# Altium schematic sheet new.SchDoc
size A2
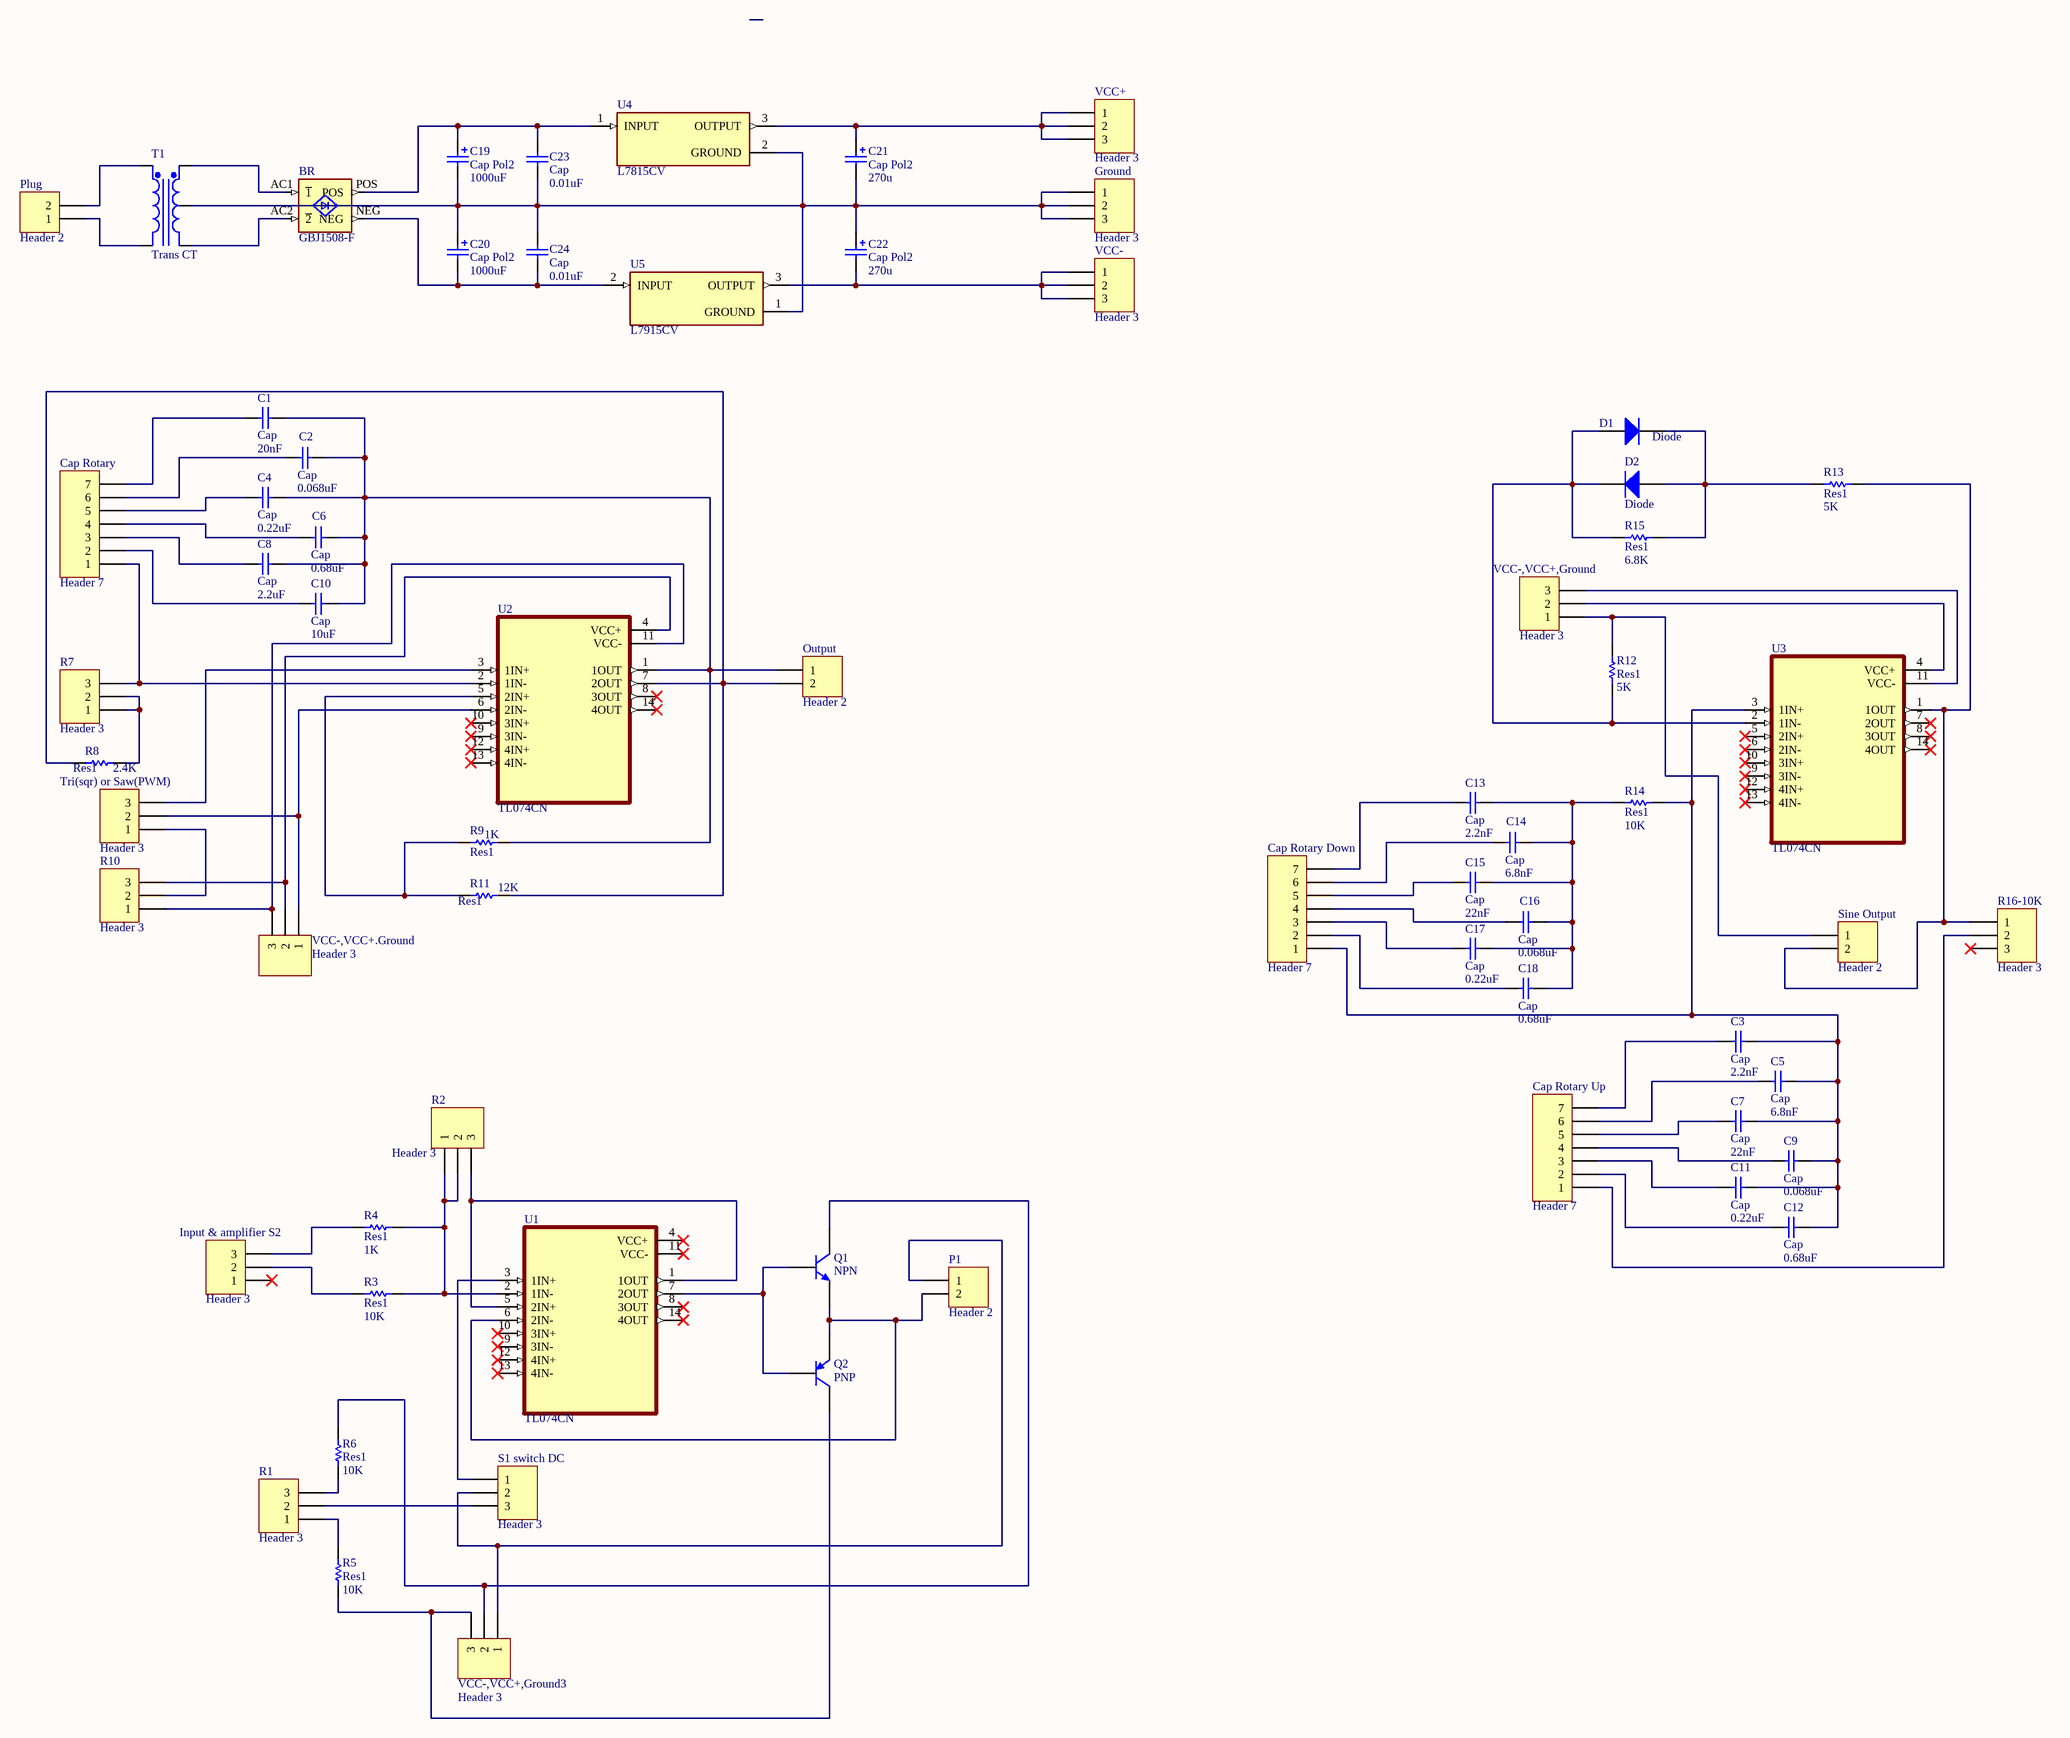
[diagram p0: new.SchDoc]

## Parts
BR  GBJ1508-F  [DIO_GBJ1508-F]
C1  Cap  value 20nF  [RAD-0.3]
C2  Cap  value 0.068uF  [RAD-0.3]
C3  Cap  value 2.2nF  [RAD-0.3]
C4  Cap  value 0.22uF  [RAD-0.3]
C5  Cap  value 6.8nF  [RAD-0.3]
C6  Cap  value 0.68uF  [RAD-0.3]
C7  Cap  value 22nF  [RAD-0.3]
C8  Cap  value 2.2uF  [RAD-0.3]
C9  Cap  value 0.068uF  [RAD-0.3]
C10  Cap  value 10uF  [RAD-0.3]
C11  Cap  value 0.22uF  [RAD-0.3]
C12  Cap  value 0.68uF  [RAD-0.3]
C13  Cap  value 2.2nF  [RAD-0.3]
C14  Cap  value 6.8nF  [RAD-0.3]
C15  Cap  value 22nF  [RAD-0.3]
C16  Cap  value 0.068uF  [RAD-0.3]
C17  Cap  value 0.22uF  [RAD-0.3]
C18  Cap  value 0.68uF  [RAD-0.3]
C19  Cap Pol2  value 1000uF  [POLAR0.8]
C20  Cap Pol2  value 1000uF  [POLAR0.8]
C21  Cap Pol2  value 270u  [POLAR0.8]
C22  Cap Pol2  value 270u  [POLAR0.8]
C23  Cap  value 0.01uF  [RAD-0.3]
C24  Cap  value 0.01uF  [RAD-0.3]
Cap_Rotary  Header 7  [HDR1X7]
Cap_Rotary_Down  Header 7  [HDR1X7]
Cap_Rotary_Up  Header 7  [HDR1X7]
D1  Diode  [SMC]
D2  Diode  [SMC]
Ground  Header 3  [HDR1X3]
Input_&_amplifier_S2  Header 3  [HDR1X3]
Output  Header 2  [HDR1X2]
P1  Header 2  [HDR1X2]
Plug  Header 2  [HDR1X2]
Q1  NPN  [TO-226-AA]
Q2  PNP  [SOT-23B_N]
R1  Header 3  [HDR1X3]
R2  Header 3  [HDR1X3]
R3  Res1  value 10K  [AXIAL-0.3]
R4  Res1  value 1K  [AXIAL-0.3]
R5  Res1  value 10K  [AXIAL-0.3]
R6  Res1  value 10K  [AXIAL-0.3]
R7  Header 3  [HDR1X3]
R8  Res1  value 2.4K  [AXIAL-0.3]
R9  Res1  value 1K  [AXIAL-0.3]
R10  Header 3  [HDR1X3]
R11  Res1  value 12K  [AXIAL-0.3]
R12  Res1  value 5K  [AXIAL-0.3]
R13  Res1  value 5K  [AXIAL-0.3]
R14  Res1  value 10K  [AXIAL-0.3]
R15  Res1  value 6.8K  [AXIAL-0.3]
R16-10K  Header 3  [HDR1X3]
S1_switch_DC  Header 3  [HDR1X3]
Sine_Output  Header 2  [HDR1X2]
T1  Trans CT  [TRF_5]
Tri(sqr)_or_Saw(PWM)  Header 3  [HDR1X3]
U1  TL074CN  [DIP794W45P254L1969H508Q14]
U2  TL074CN  [DIP794W45P254L1969H508Q14]
U3  TL074CN  [DIP794W45P254L1969H508Q14]
U4  L7815CV  [TO255P1040X460X1935-3]
U5  L7915CV  [TO255P1040X460X1935-3]
VCC+  Header 3  [HDR1X3]
VCC-  Header 3  [HDR1X3]
VCC-,VCC+,Ground  Header 3  [HDR1X3]
VCC-,VCC+,Ground3  Header 3  [HDR1X3]
VCC-,VCC+.Ground  Header 3  [HDR1X3]

## Nets
NetBR_AC1: BR.AC1(~{1}) T1.3(Sec+)
NetBR_AC2: BR.AC2(~{2}) T1.5(Sec-)
NetBR_NEG: BR.NEG C20.2 C24.1 U5.2(INPUT)
NetBR_POS: BR.POS C19.1 C23.2 U4.1(INPUT)
NetC1_1: C1.1 Cap_Rotary.7
NetC1_2: C1.2 C2.2 C4.2 C6.2 C8.2 C10.2 Output.1 R9.1 U2.1(1OUT)
NetC2_1: C2.1 Cap_Rotary.6
NetC3_1: C3.1 Cap_Rotary_Up.7
NetC3_2: C3.2 C5.2 C7.2 C9.2 C11.2 C12.2 Cap_Rotary_Down.1 R14.2 U3.3(1IN+)
NetC4_1: C4.1 Cap_Rotary.5
NetC5_1: C5.1 Cap_Rotary_Up.6
NetC6_1: C6.1 Cap_Rotary.4
NetC7_1: C7.1 Cap_Rotary_Up.5
NetC8_1: C8.1 Cap_Rotary.3
NetC9_1: C9.1 Cap_Rotary_Up.4
NetC10_1: C10.1 Cap_Rotary.2
NetC11_1: C11.1 Cap_Rotary_Up.3
NetC12_1: C12.1 Cap_Rotary_Up.2
NetC13_1: C13.1 Cap_Rotary_Down.7
NetC13_2: C13.2 C14.2 C15.2 C16.2 C17.2 C18.2 R14.1
NetC14_1: C14.1 Cap_Rotary_Down.6
NetC15_1: C15.1 Cap_Rotary_Down.5
NetC16_1: C16.1 Cap_Rotary_Down.4
NetC17_1: C17.1 Cap_Rotary_Down.3
NetC18_1: C18.1 Cap_Rotary_Down.2
NetC19_2: C19.2 C20.1 C21.2 C22.1 C23.1 C24.2 Ground.1 Ground.2 Ground.3 T1.4(SecCT) U4.2(GROUND) U5.1(GROUND)
NetC21_1: C21.1 U4.3(OUTPUT) VCC+.1 VCC+.2 VCC+.3
NetC22_2: C22.2 U5.3(OUTPUT) VCC-.1 VCC-.2 VCC-.3
NetCap_Rotary_1: Cap_Rotary.1 R7.3 U2.2(1IN-)
NetCap_Rotary_Up_1: Cap_Rotary_Up.1 R16-10K.2
NetD1_1: D1.1(A) D2.2(K) R12.1 R15.1 U3.2(1IN-)
NetD1_2: D1.2(K) D2.1(A) R13.1 R15.2
NetInput_&_amplifier_S2_2: Input_&_amplifier_S2.2 R3.1
NetInput_&_amplifier_S2_3: Input_&_amplifier_S2.3 R4.1
NetOutput_2: Output.2 R8.1 R11.2 U2.7(2OUT)
NetP1_1: P1.1 S1_switch_DC.2 VCC-,VCC+,Ground3.1
NetP1_2: P1.2 Q1.3(E) Q2.3(E) U1.6(2IN-)
NetPlug_1: Plug.1 T1.2(Pri-)
NetPlug_2: Plug.2 T1.1(Pri+)
NetQ1_1: Q1.1(C) R6.2 VCC-,VCC+,Ground3.2
NetQ1_2: Q1.2(B) Q2.2(B) U1.7(2OUT)
NetQ2_1: Q2.1(C) R5.1 VCC-,VCC+,Ground3.3
NetR1_1: R1.1 R5.2
NetR1_2: R1.2 S1_switch_DC.3
NetR1_3: R1.3 R6.1
NetR2_1: R2.1 R2.2 R3.2 R4.2 U1.2(1IN-)
NetR2_3: R2.3 U1.1(1OUT) U1.5(2IN+)
NetR7_1: R7.1 R7.2 R8.2
NetR9_2: R9.2 R11.1 U2.5(2IN+)
NetR10_1: R10.1 U2.11(VCC-) VCC-,VCC+.Ground.3
NetR10_2: R10.2 Tri(sqr)_or_Saw(PWM).1
NetR10_3: R10.3 U2.4(VCC+) VCC-,VCC+.Ground.2
NetR12_2: R12.2 Sine_Output.1 VCC-,VCC+,Ground.1
NetR13_2: R13.2 R16-10K.1 Sine_Output.2 U3.1(1OUT)
NetS1_switch_DC_1: S1_switch_DC.1 U1.3(1IN+)
NetTri(sqr)_or_Saw(PWM)_2: Tri(sqr)_or_Saw(PWM).2 U2.6(2IN-) VCC-,VCC+.Ground.1
NetTri(sqr)_or_Saw(PWM)_3: Tri(sqr)_or_Saw(PWM).3 U2.3(1IN+)
NetU3_4: U3.4(VCC+) VCC-,VCC+,Ground.2
NetU3_11: U3.11(VCC-) VCC-,VCC+,Ground.3

Not connected (* = marked no-connect by the designer): Input_&_amplifier_S2 1*; R16-10K 3*; U1 4(VCC+)* 8(3OUT)* 9(3IN-)* 10(3IN+)* 11(VCC-)* 12(4IN+)* 13(4IN-)* 14(4OUT)*; U2 8(3OUT)* 9(3IN-)* 10(3IN+)* 12(4IN+)* 13(4IN-)* 14(4OUT)*; U3 5(2IN+)* 6(2IN-)* 7(2OUT)* 8(3OUT)* 9(3IN-)* 10(3IN+)* 12(4IN+)* 13(4IN-)* 14(4OUT)*

## Library data of the parts
BR = GBJ1508-F: Bridge Rectifier Single Phase Standard 800V Through Hole GBJ; MF: Diodes Inc.; Value: *; SnapEDA_Link: https://www.snapeda.com/parts/GBJ1508-F/Diodes%20Inc./view-part/130069/?ref=snap; Mouser-Purchase-URL: https://snapeda.com/shop?store=Mouser&id=130069; Availability: Unavailable; Price: None; Package: SIP-4 Diodes Inc.; MP: GBJ1508-F
C1-C18 C23 C24 = Cap: Capacitor; Published: 8-Jun-2000; LatestRevisionDate: 17-Jul-2002; LatestRevisionNote: Re-released for DXP Platform.; PackageReference: RAD-0.3; Publisher: Altium Limited; PackageDescription: Radial Cap, Thru-Hole; 2 Leads; 0.3 in Pin Spacing
C19-C22 = Cap Pol2: Polarized Capacitor (Axial); Published: 8-Jun-2000; LatestRevisionDate: 17-Jul-2002; LatestRevisionNote: Re-released for DXP Platform.; PackageReference: POLAR0.8; Publisher: Altium Limited; PackageDescription: Polarized Capacitor; 2 Leads
Cap_Rotary Cap_Rotary_Down Cap_Rotary_Up = Header 7: Header, 7-Pin; LatestRevisionDate: 17-Jul-2002; LatestRevisionNote: Re-released for DXP Platform.; Publisher: Altium Limited
D1 D2 = Diode: Default Diode; Published: 8-Jun-2000; LatestRevisionDate: 17-Jul-2002; LatestRevisionNote: Re-released for DXP Platform.; PackageVersion: Sep-1996; PackageReference: SMC; Publisher: Altium Limited; PackageDescription: DO-214-AB/SMC; 2 C-Bend Leads; Body 7.9 x 5.9 mm, inc. leads (LxW); Code_JEDEC: DO-214-AB
Ground Input_&_amplifier_S2 R1 R2 R7 R10 R16-10K S1_switch_DC Tri(sqr)_or_Saw(PWM) VCC+ VCC- VCC-,VCC+,Ground VCC-,VCC+,Ground3 VCC-,VCC+.Ground = Header 3: Header, 3-Pin; LatestRevisionDate: 17-Jul-2002; LatestRevisionNote: Re-released for DXP Platform.; Publisher: Altium Limited
Output P1 Plug Sine_Output = Header 2: Header, 2-Pin; LatestRevisionDate: 17-Jul-2002; LatestRevisionNote: Re-released for DXP Platform.; Publisher: Altium Limited
Q1 = NPN: NPN Bipolar Transistor; Published: 8-Jun-2000; LatestRevisionDate: 17-Jul-2002; LatestRevisionNote: Re-released for DXP Platform.; PackageReference: TO-226-AA; Publisher: Altium Limited; PackageDescription: TO, Flat Index; 3 In-Line, Axial Leads; Body Dia. 4.8mm; Leads 0.55 x 0.51 mm (max); Code_JEDEC: TO-226-AA
Q2 = PNP: PNP Bipolar Transistor; Published: 8-Jun-2000; LatestRevisionDate: 29-May-2009; LatestRevisionNote: IPC-7351 Footprint Added.; PackageVersion: Aug-1999; PackageReference: SOT-23B; Publisher: Altium Limited; PackageDescription: 3-Pin SOT-23 Package 0.95 mm Pitch, 2.4 mm Lead Span
R3-R6 R8 R9 R11-R15 = Res1: Resistor; Published: 8-Jun-2000; LatestRevisionDate: 17-Jul-2002; LatestRevisionNote: Re-released for DXP Platform.; PackageReference: AXIAL-0.3; Publisher: Altium Limited; PackageDescription: Axial Device, Thru-Hole; 2 Leads; 0.3 in Pin Spacing
T1 = Trans CT: Center-Tapped Transformer (Coupled Inductor Model); Published: 8-Jun-2000; LatestRevisionDate: 17-Jul-2002; LatestRevisionNote: Re-released for DXP Platform.; PackageReference: TRF_5; Publisher: Altium Limited; PackageDescription: Transformer; 5 Leads
U1-U3 = TL074CN: Quad Low-Noise JFET-Input General-Purpose Operational Amplifier 14-PDIP 0 to 70; MF: Texas Instruments; SnapEDA_Link: https://www.snapeda.com/parts/TL074CN/Texas%20Instruments/view-part/4796371/?ref=snap; Price: None; Mouser-Purchase-URL: https://snapeda.com/shop?store=Mouser&id=4796371; Package: PDIP-14 Texas Instruments; Availability: Good; Texas_Instruments-Purchase-URL: https://snapeda.com/shop?store=Texas+Instruments&id=4796371; MP: TL074CN; DigiKey-Purchase-URL: https://snapeda.com/shop?store=DigiKey&id=4796371; Value: *
U4 = L7815CV: Linear Voltage Regulator IC 1 Output 1.5A TO-220AB; MF: STMicroelectronics; Package: TO-220 STMicroelectronics; MP: L7815CV; Availability: Unavailable; Price: None; Value: *; SnapEDA_Link: https://www.snapeda.com/parts/L7815CV/STMicroelectronics/view-part/4730/?ref=snap
U5 = L7915CV: Linear Voltage Regulator IC 1 Output 1.5A TO-220AB; MF: STMicroelectronics; Value: *; Package: TO-220 STMicroelectronics; Availability: Unavailable; SnapEDA_Link: https://www.snapeda.com/parts/L7915CV/STMicroelectronics/view-part/8087/?ref=snap; MP: L7915CV; Price: None